# EAGLE design pc_rpimax30205_brk (EAGLE 6.6.0)
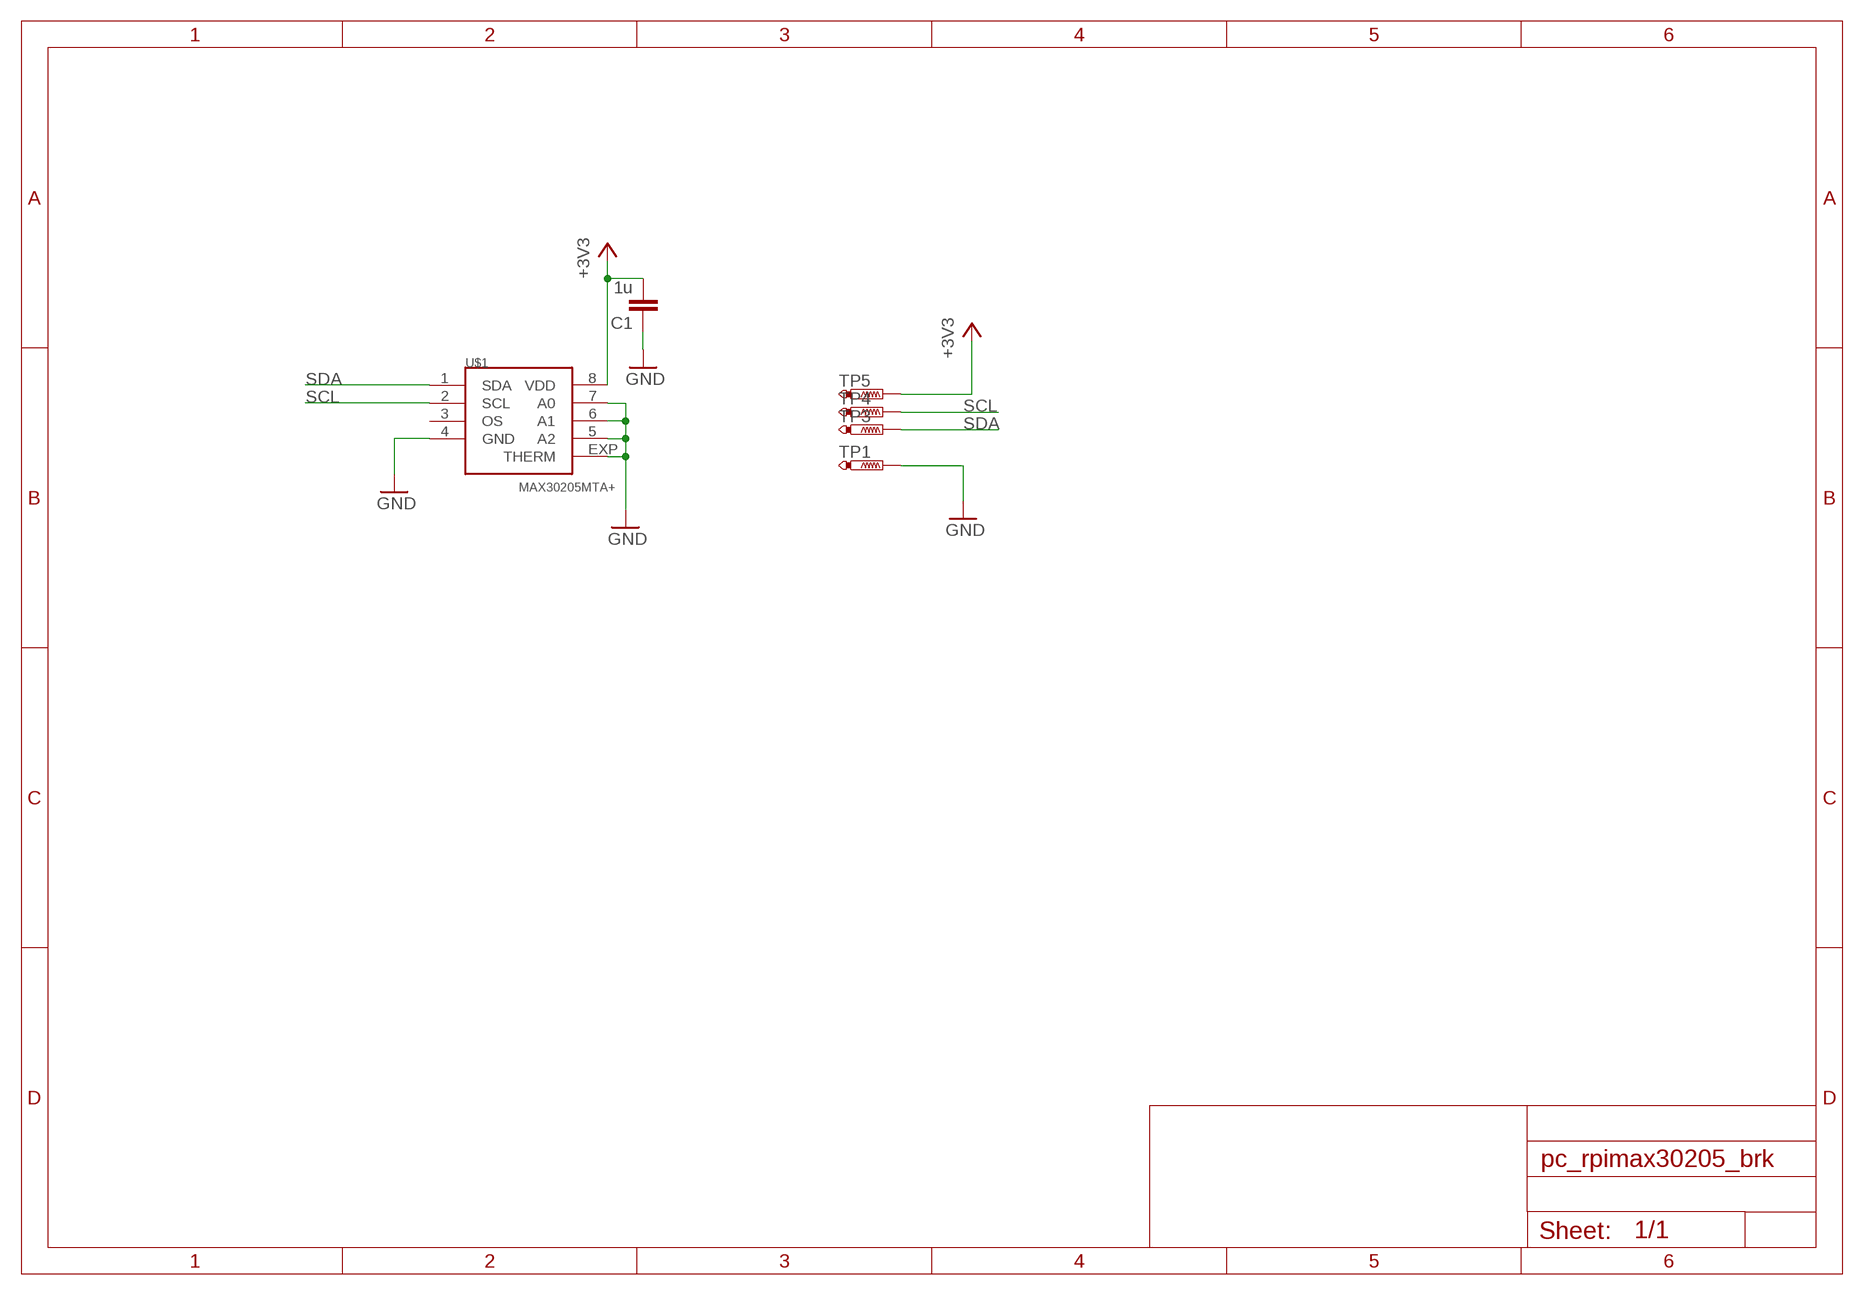
[diagram p0: schematic, sheet 1]

## Parts
C1  1u  C-EUC0805  [C0805]
TP1  PTR1TP20SQ  [TP20SQ]
TP3  PTR1TP20SQ  [TP20SQ]
TP4  PTR1TP20SQ  [TP20SQ]
TP5  PTR1TP20SQ  [TP20SQ]
U$1  MAX30205MTA+  [TDFN-08]

## Nets
+3V3: C1.2 TP5.TP U$1.8(VDD)
GND [gnd]: C1.1 TP1.TP U$1.4(GND) U$1.5(A2) U$1.6(A1) U$1.7(A0) U$1.EXP(THERM)
SCL: TP4.TP U$1.2(SCL)
SDA: TP3.TP U$1.1(SDA)
Unconnected: U$1.3(OS)

## Library data of the parts
C1 = rcl:C-EU: CAPACITOR, European symbol
TP1 TP3-TP5 = testpad:PTR1: TEST PIN
U$1 = circuitects:MAX30205

## Net classes
2 gnd: width 0.102 mm, drill 0.1 mm

## Board
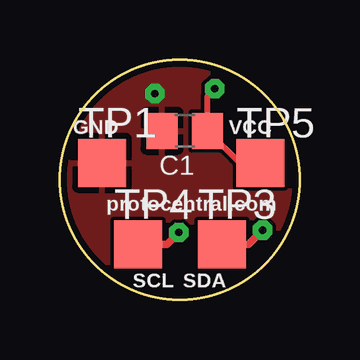
[diagram p1: board, top side]
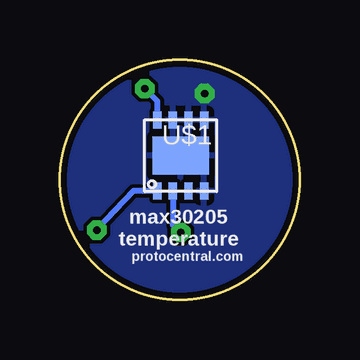
[diagram p2: board, bottom side, seen from below]

Size 10 x 10 mm. Coordinates in mm from the lower left corner, seen from the top.
Outline: circle at 5,5 radius 5
Copper layers (1*2*15*16): Top 0.035mm / dielectric 1.5mm / Route2 0.035mm / dielectric 0.15mm / Route15 0.035mm / dielectric 0.2mm / Bottom 0.035mm
Design rules "Circuitects-Rules": minimum track width 6mil, minimum drill 0.3mm, track to track 6mil, track to pad 6mil, pad to pad 6mil, via to via 6mil, smd to smd 6mil, copper to edge 10mil, drill to drill 8mil, minimum pad ring 12mil, minimum via ring 10mil, stop-mask expansion 4mil, vias tented up to drill 25mil, thermal gap 10mil

### Footprints (pad centres in the part's own frame; a part is rotated, then mirrored left to right if it is on the bottom)
C0805 = smd 1.3 x 1.5: 1 -0.95,0; 2 0.95,0
TP20SQ = smd 2 x 2: TP 0,0
TDFN-08 = smd 0.7 x 0.35: 1 -1.475,0.975; 2 -1.475,0.325; 3 -1.475,-0.325; 4 -1.475,-0.975; 5 1.475,-0.975; 6 1.475,-0.325; 7 1.475,0.325; 8 1.475,0.975 | smd 1.58 x 2.35: EXP 0,0

### Placement (x,y rotation side)
C1  5.21,7.04 0 top
TP1  1.76,5.7 0 top
TP3  6.76,2.3 0 top
TP4  3.26,2.3 0 top
TP5  8.36,5.7 0 top
U$1  4.96,6.01 90 bottom

### Tracks (layer width: path | path; a pad name or v marks a point on that pad's centre or on a via)
+3V3  (via drill 0.3)
  Top 0.254: TP5.TP 7.5,5.7 C1.2 6.16,8.5 v6.46,8.8
  Bottom 0.254: U$1.8 5.93,8.28 v6.46,8.8
GND  (via drill 0.3)
  other vias: 3.96,8.6
  pour Top: -1.04,10.1 9.96,10.1 9.96,-0.9 -1.04,-0.9
  pour Bottom: -1.04,10.1 9.96,10.1 9.96,-0.9 -1.04,-0.9
SCL  (via drill 0.3)
  Top 0.305: TP4.TP 4.46,2.3 v4.96,2.8
  Bottom 0.254: U$1.2 5.29,3.12 v4.96,2.8
SDA  (via drill 0.3)
  Top 0.305: TP3.TP 7.86,2.3 v8.46,2.9
  Bottom 0.254: U$1.1 6.92,4.53 v8.46,2.9

### Text on the board
tPlace: GND | VCC | protocentral.com | SCL | SDA
bPlace: max30205 / temperature | protocentral.com